# EAGLE design N0llELAB_final (EAGLE 6.6.0)
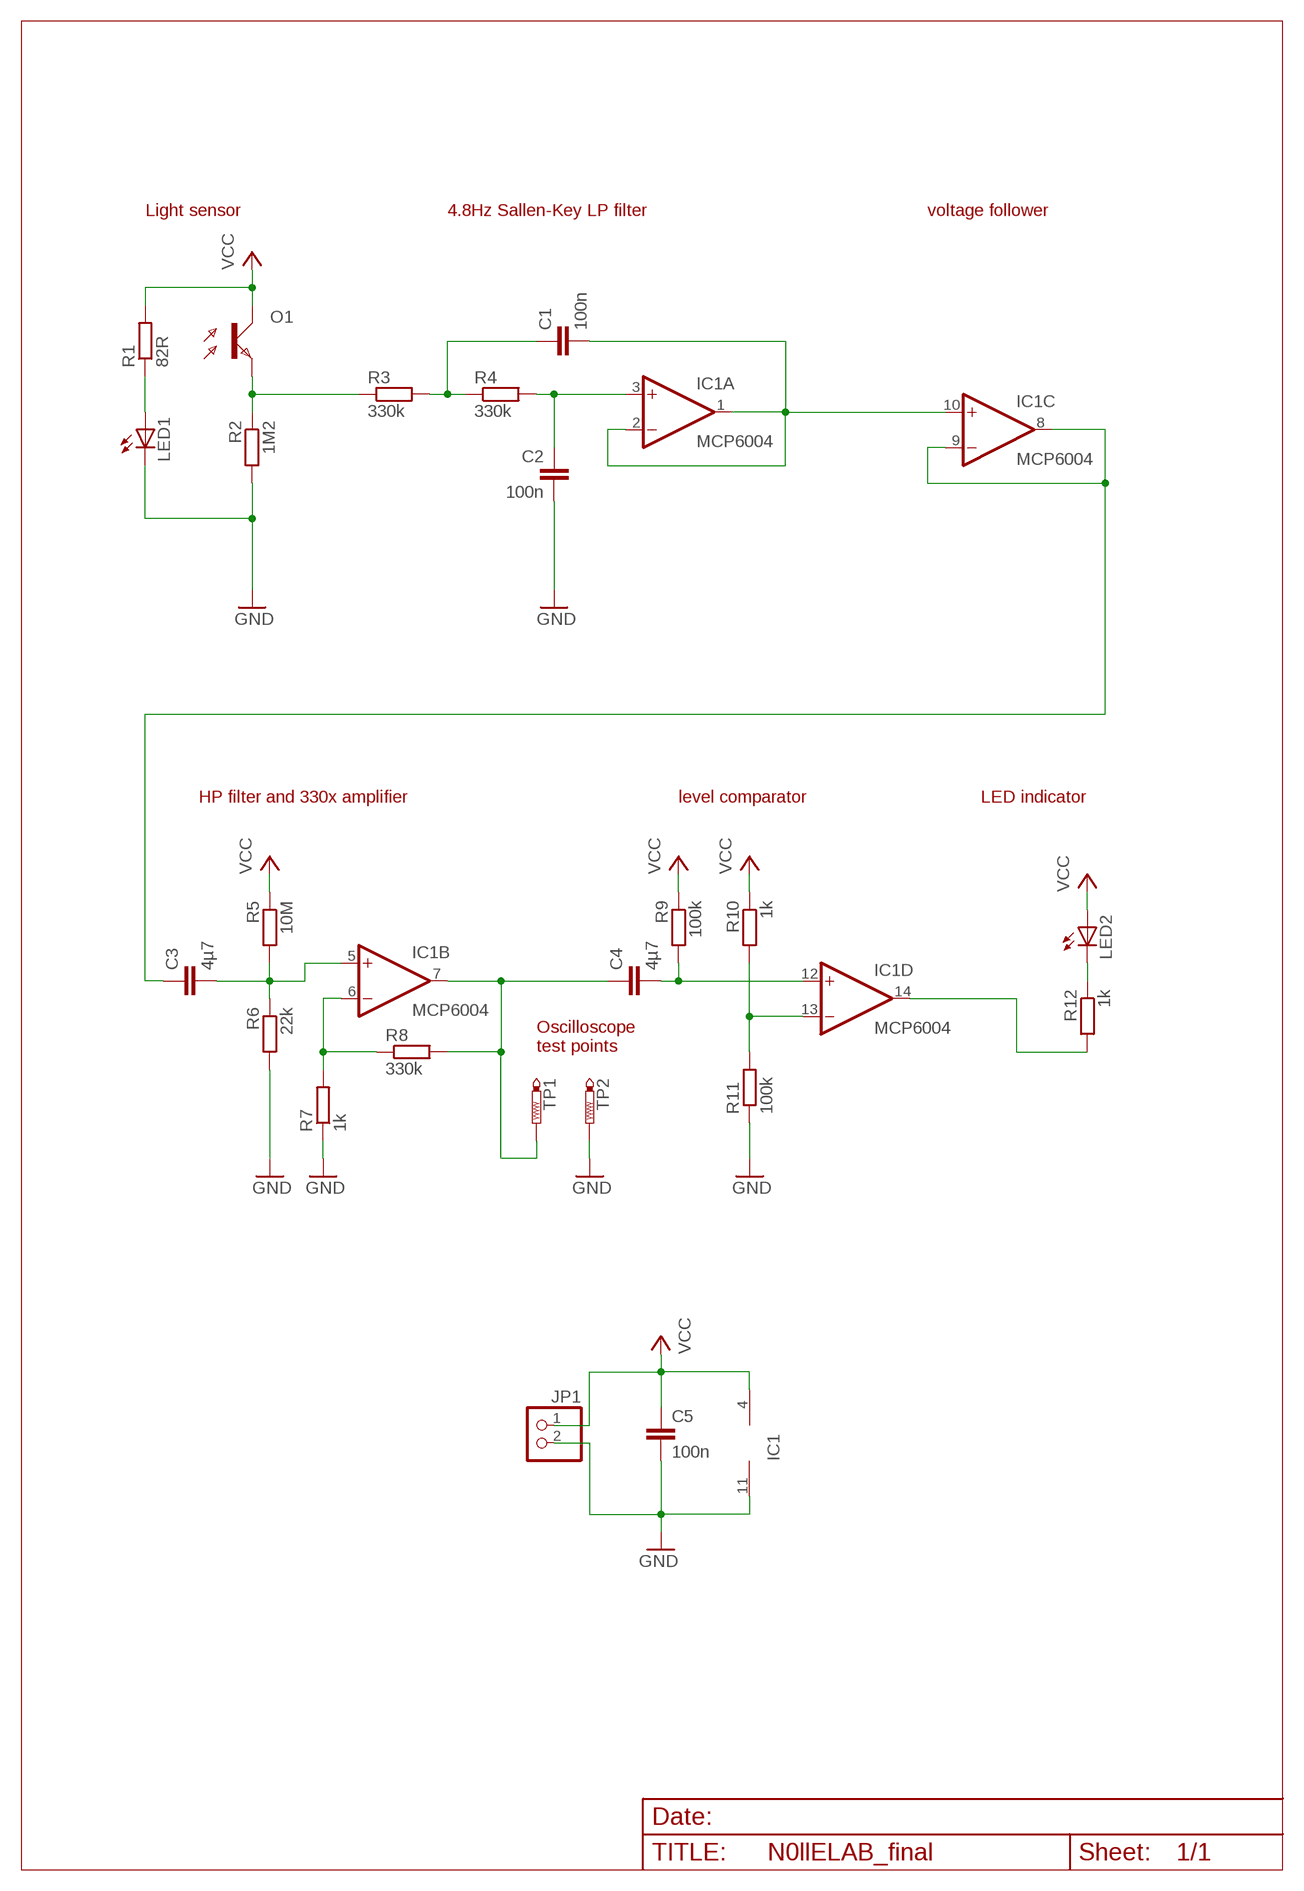
[diagram p0: schematic, sheet 1]

## Parts
C1  100n  C-EU050-024X044  [C050-024X044]
C2  100n  C-EU050-024X044  [C050-024X044]
C3  4µ7  C-EU050-024X044  [C050-024X044]
C4  4µ7  C-EU050-024X044  [C050-024X044]
C5  100n  C-EU050-024X044  [C050-024X044]
IC1  MCP6004  LM324N  [DIL14]
JP1  PINHD-1X02_2.54-S  [1X02-S]
LED1  LED5MM-90L  [LED5MM-90L]
LED2  LED5MM  [LED5MM]
O1  OPTOTRANS5MM-90R  [LED5MM-90R]
R1  82R  R-EU_0207/2V  [0207/2V]
R2  1M2  R-EU_0207/2V  [0207/2V]
R3  330k  R-EU_0207/2V  [0207/2V]
R4  330k  R-EU_0207/2V  [0207/2V]
R5  10M  R-EU_0207/2V  [0207/2V]
R6  22k  R-EU_0207/2V  [0207/2V]
R7  1k  R-EU_0207/2V  [0207/2V]
R8  330k  R-EU_0207/2V  [0207/2V]
R9  100k  R-EU_0207/2V  [0207/2V]
R10  1k  R-EU_0207/2V  [0207/2V]
R11  100k  R-EU_0207/2V  [0207/2V]
R12  1k  R-EU_0207/2V  [0207/2V]
TP1  PTR1PAD1-13  [P1-13]
TP2  PTR1PAD1-13  [P1-13]

## Nets
GND: C2.2 C5.2 IC1.11(P:V-) JP1.2 LED1.K(C) R2.2 R6.2 R7.1 R11.1 TP2.1(TP)
N$1: O1.A(E) R2.1 R3.1
N$2: C2.1 IC1.3(A:+IN) R4.2
N$3: C1.1 R3.2 R4.1
N$4: C4.2 IC1.12(D:+IN) R9.2
N$6: IC1.13(D:-IN) R10.2 R11.2
N$7: IC1.14(D:OUT) R12.2
N$8: LED2.K(C) R12.1
N$9: LED1.A R1.1
N$10: C3.1 IC1.8(C:OUT) IC1.9(C:-IN)
N$11: C1.2 IC1.1(A:OUT) IC1.2(A:-IN) IC1.10(C:+IN)
N$12: C3.2 IC1.5(B:+IN) R5.2 R6.1
N$13: IC1.6(B:-IN) R7.2 R8.1
N$15: C4.1 IC1.7(B:OUT) R8.2 TP1.1(TP)
VCC: C5.1 IC1.4(P:V+) JP1.1 LED2.A O1.K(C) R1.2 R5.1 R9.1 R10.1

## Notes on the sheet
- Light sensor | 4.8Hz Sallen-Key LP filter | voltage follower
- HP filter and 330x amplifier | level comparator | LED indicator
- Oscilloscope
  test points
- IC1

## Library data of the parts
C1-C5 = rcl:C-EU: CAPACITOR, European symbol
IC1 = linear:LM324: OP AMP
JP1 = pinhead-2:PINHD-1X02: PIN HEADER
LED1 = schwen:LED5MM-90L
LED2 = schwen:LED5MM
O1 = schwen:OPTOTRANS5MM-90R
R1-R12 = rcl:R-EU_: RESISTOR, European symbol
TP1 TP2 = testpad:PTR1: TEST PIN

## Board
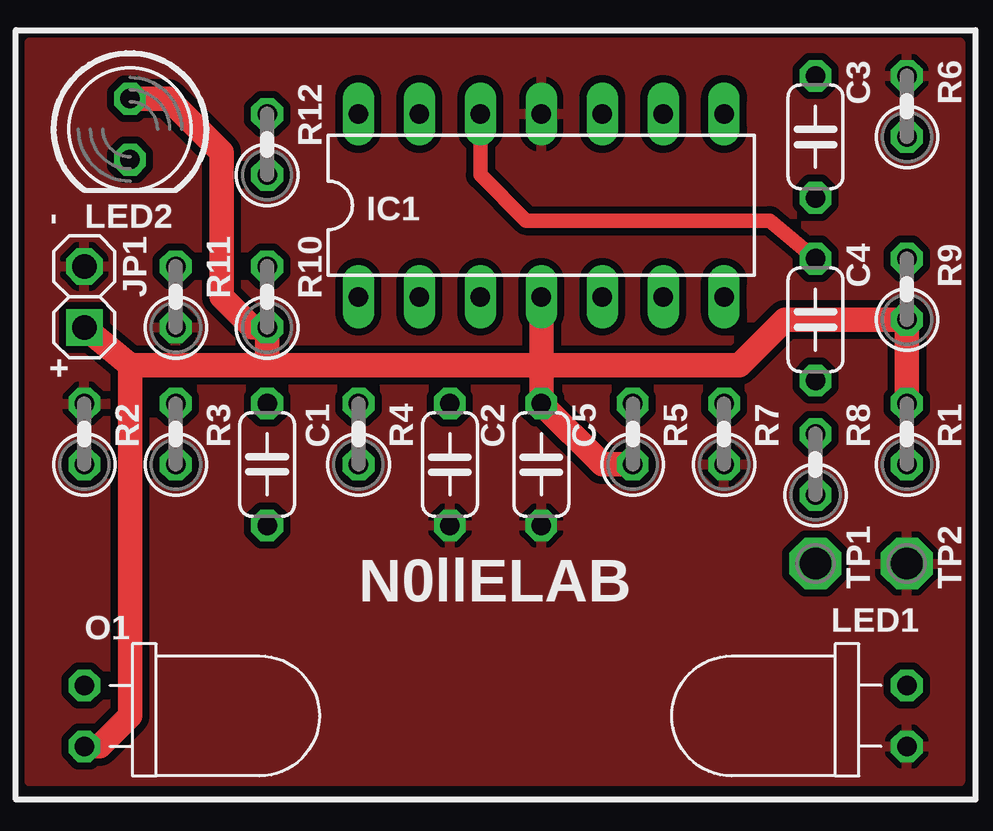
[diagram p1: board, top side]
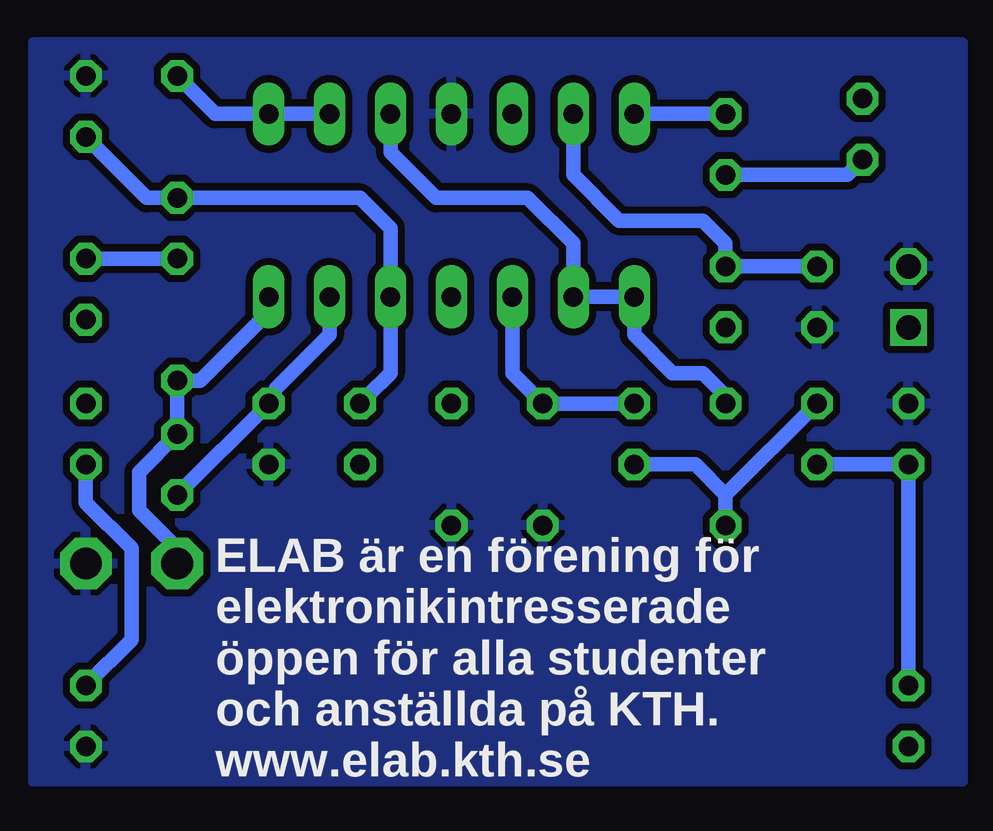
[diagram p2: board, bottom side, seen from below]

No outline drawn. Coordinates in mm, seen from the top.
Copper layers (1*16): Top 0.035mm / dielectric 1.5mm / Bottom 0.035mm
Design rules "SeeedStudio_DRU-2layer_no_angle_20130527": minimum track width 6mil, minimum drill 12mil, track to track 6mil, track to pad 6mil, pad to pad 6mil, via to via 6mil, smd to smd 0mil, copper to edge 10mil, drill to drill 10mil, minimum pad ring 10mil, minimum via ring 6mil, stop-mask expansion 2mil, vias tented up to drill 25mil, thermal gap 10mil

### Footprints (pad centres in the part's own frame; a part is rotated, then mirrored left to right if it is on the bottom)
C050-024X044 = drill 0.813 octagon: 1 -2.54,0; 2 2.54,0
DIL14 = drill 0.813 long: 1 -7.62,-3.81; 2 -5.08,-3.81; 3 -2.54,-3.81; 4 0,-3.81; 5 2.54,-3.81; 6 5.08,-3.81; 7 7.62,-3.81; 8 7.62,3.81; 9 5.08,3.81; 10 2.54,3.81; 11 0,3.81; 12 -2.54,3.81; 13 -5.08,3.81; 14 -7.62,3.81
1X02-S = drill 1.016 square: 1 -1.27,0 | drill 1.016 octagon: 2 1.27,0
LED5MM-90L = drill 0.813 octagon: A -1.27,0; K 1.27,0
LED5MM = drill 0.813 octagon: A -1.27,0; K 1.27,0
LED5MM-90R = drill 0.813 octagon: A -1.27,0; K 1.27,0
0207/2V = drill 0.813 octagon: 1 -1.27,0; 2 1.27,0
P1-13 = drill 1.321 pad 2.159 octagon: 1 0,0

### Placement (x,y rotation side)
C1  10.48,13.97 90 top
C2  18.1,13.97 270 top
C3  33.34,27.62 270 top
C4  33.34,20 90 top
C5  21.91,13.97 270 top
IC1  21.91,24.77 0 top
JP1  2.86,20.95 90 top
LED1  37.15,3.49 270 top
LED2  4.76,27.94 270 top
O1  2.86,3.49 270 top
R1  37.15,15.24 90 top
R2  2.86,15.24 90 top
R3  6.67,15.24 90 top
R4  14.29,15.24 90 top
R5  25.72,15.24 90 top
R6  37.15,28.89 90 top
R7  29.53,15.24 90 top
R8  33.34,13.97 90 top
R9  37.15,21.27 90 top
R10  10.48,20.95 90 top
R11  6.67,20.95 90 top
R12  10.48,27.3 90 top
TP1  33.34,9.84 0 top
TP2  37.15,9.84 0 top

### Tracks (layer width: path | path; a pad name or v marks a point on that pad's centre or on a via)
GND
  pour Bottom (isolate 0.3): 39.37,31.56 39.37,0.76 0.57,0.76 0.57,31.56
  pour Top (isolate 0.3): 39.37,31.56 39.37,0.76 0.57,0.76 0.57,31.56
N$1
  Bottom 0.61: R3.1 R2.1 O1.A
N$2
  Bottom 0.61: R4.2 C2.1 19.37,17.78 IC1.3
N$3
  Bottom 0.61: R3.2 10.48,12.7 | 10.48,12.7 C1.1 | R4.1 11.75,13.97 10.48,12.7
N$4
  Top 0.61: IC1.12 19.37,26.04 21.27,24.13 31.43,24.13 C4.2
  Bottom 0.61: C4.2 R9.2
N$6
  Bottom 0.61: R11.2 R10.2 10.48,23.18 11.43,24.13 14.92,24.13 16.83,26.04 IC1.13
N$7
  Bottom 0.61: IC1.14 R12.2
N$8
  Bottom 0.61: R12.1 5.4,26.04 LED2.K
N$9
  Bottom 0.61: R1.1 37.15,12.38 35.24,10.48 35.24,6.67 LED1.A
N$10
  Bottom 0.61: IC1.9 IC1.8 31.75,28.57 C3.1
N$11
  Bottom 0.61: IC1.10 24.45,26.99 22.54,25.08 18.73,25.08 16.83,23.18 IC1.2 IC1.1 14.29,19.37 12.7,17.78 11.43,17.78 10.48,16.83 C1.2
N$12
  Bottom 0.61: R5.2 25.4,16.83 24.45,17.78 IC1.5 24.45,23.81 25.72,25.08 C3.2 34.61,25.08 R6.1
N$13
  Bottom 0.61: IC1.6 26.99,19.37 29.21,17.14 R7.2 R8.1
N$15
  Bottom 0.61: IC1.7 29.53,20.32 32.38,17.46 C4.1 R8.2 34.92,13.65 34.92,12.06 33.34,10.48 TP1.1
VCC
  Top 1.016: IC1.4 21.91,18.1 | 21.91,18.1 C5.1 24.45,13.97 R5.1 | 21.91,18.1 10.48,18.1 | 10.48,18.1 R10.1 9.84,19.68 8.57,20.95 8.57,26.99 6.35,29.21 LED2.A | 10.48,18.1 4.76,18.1 | 4.76,18.1 JP1.1 | O1.K 3.49,2.22 4.76,3.49 4.76,18.1 | 21.91,18.1 30.16,18.1 30.48,18.41 32.07,20 R9.1 R1.2

### Text on the board
tPlace: C3 | R6 | R12 | - | LED2 | IC1 | JP1 | R11 | R10 | C4 | R9 | + | R2 | R3 | C1 | R4 | C2 | C5 | R5 | R7 | R8 | R1 | TP1 | TP2 | O1 | LED1
bPlace: ELAB är en förening för / elektronikintresserade / öppen för alla studenter / och anställda på KTH. / www.elab.kth.se
tNames: N0llELAB